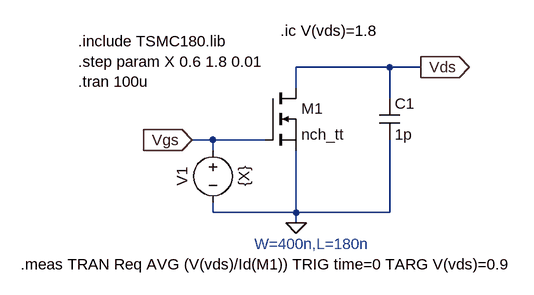
[diagram p0: schematic Prob_1a2.asc]
Prob_1a2.asc, the LTspice schematic file:
Version 4
SHEET 1 880 680
WIRE 288 48 144 48
WIRE 336 48 288 48
WIRE 144 80 144 48
WIRE 288 96 288 48
WIRE 16 160 -16 160
WIRE 96 160 16 160
WIRE 16 176 16 160
WIRE 16 272 16 256
WIRE 144 272 144 176
WIRE 144 272 16 272
WIRE 288 272 288 160
WIRE 288 272 144 272
WIRE 144 288 144 272
FLAG -16 160 Vgs
IOPIN -16 160 In
FLAG 144 288 0
FLAG 336 48 Vds
IOPIN 336 48 Out
SYMBOL nmos 96 80 R0
SYMATTR InstName M1
SYMATTR Value nch_tt
SYMATTR Value2 W=400n,L=180n
SYMBOL voltage 16 160 R0
WINDOW 0 -32 56 VBottom 2
WINDOW 3 32 56 VTop 2
WINDOW 123 0 0 Left 0
WINDOW 39 0 0 Left 0
SYMATTR InstName V1
SYMATTR Value {X}
SYMBOL cap 272 96 R0
SYMATTR InstName C1
SYMATTR Value 1p
SYMATTR SpiceLine IC=1.8
TEXT -192 8 Left 2 !.include TSMC180.lib\n.step param X 0.6 1.8 0.01\n.tran 100u
TEXT 120 -8 Left 2 !.ic V(vds)=1.8
TEXT -280 352 Left 2 !.meas TRAN Req AVG (V(vds)/Id(M1)) TRIG time=0 TARG V(vds)=0.9
TEXT 80 320 Left 2 ;W=400n,L=180n

The netlist it stands for:
* Prob_1a2.asc
M1 Vds Vgs 0 0 nch_tt W=400n,L=180n
V1 Vgs 0 {X}
C1 Vds 0 1p IC=1.8
.model NMOS NMOS
.model PMOS PMOS
.lib standard.mos
.include TSMC180.lib
.step param X 0.6 1.8 0.01
.tran 100u
.ic V(vds)=1.8
.meas TRAN Req AVG (V(vds)/Id(M1)) TRIG time=0 TARG V(vds)=0.9
* W=400n,L=180n
.backanno
.end

* Results of the author's LTspice run, read from the files saved beside the schematic
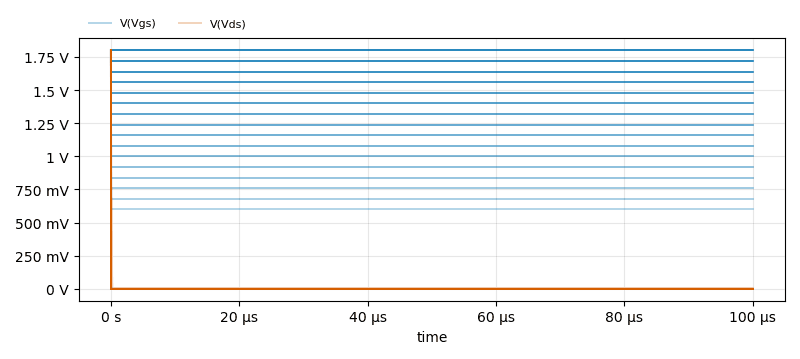
[diagram p1: Transient Analysis of Prob_1a2.asc, plotted from the saved traces]
* Transient Analysis, 121 runs:
*   V(Vgs) [run 1]: min 600 mV, max 600 mV, average 600 mV, rms 600 mV, last 600 mV
*   V(Vgs) [run 2]: min 680 mV, max 680 mV, average 680 mV, rms 680 mV, last 680 mV
*   V(Vgs) [run 3]: min 760 mV, max 760 mV, average 760 mV, rms 760 mV, last 760 mV
*   V(Vgs) [run 4]: min 840 mV, max 840 mV, average 840 mV, rms 840 mV, last 840 mV
*   V(Vgs) [run 5]: min 920 mV, max 920 mV, average 920 mV, rms 920 mV, last 920 mV
*   V(Vgs) [run 6]: min 1 V, max 1 V, average 1 V, rms 1 V, last 1 V
*   V(Vgs) [run 7]: min 1.08 V, max 1.08 V, average 1.08 V, rms 1.08 V, last 1.08 V
*   V(Vgs) [run 8]: min 1.16 V, max 1.16 V, average 1.16 V, rms 1.16 V, last 1.16 V
*   V(Vds) [run 1]: min 0 V, max 1.8 V, average 1.867 mV, rms 46.5 mV, last 0 V
*   V(Vds) [run 2]: min 0 V, max 1.8 V, average 839.4 µV, rms 31.39 mV, last 0 V
*   V(Vds) [run 3]: min 0 V, max 1.8 V, average 500.3 µV, rms 24.24 mV, last 0 V
*   V(Vds) [run 4]: min 0 V, max 1.8 V, average 352.4 µV, rms 20.5 mV, last 0 V
*   V(Vds) [run 5]: min 0 V, max 1.8 V, average 260.2 µV, rms 17.49 mV, last 0 V
*   V(Vds) [run 6]: min 0 V, max 1.8 V, average 208 µV, rms 15.69 mV, last 0 V
*   V(Vds) [run 7]: min 0 V, max 1.8 V, average 172.9 µV, rms 14.31 mV, last 0 V
*   V(Vds) [run 8]: min 0 V, max 1.8 V, average 144.9 µV, rms 13.01 mV, last 0 V
* From the log:
*   Measurement: req
*     step  AVG(v(vds)/id(m1))  FROM  TO
*        1  134195  0  9.67646e-008
*        2  119898  0  8.56235e-008
*        3  107850  0  7.68494e-008
*        4  97620  0  6.93168e-008
*        5  88948.3  0  6.28894e-008
*        6  81220.5  0  5.72142e-008
*        7  74552.8  0  5.22654e-008
*        8  68739.1  0  4.82112e-008
*        9  63642.6  0  4.46794e-008
*       10  59156.8  0  4.15778e-008
*       11  55186.8  0  3.88297e-008
*       12  51662.8  0  3.62879e-008
*       13  48542.1  0  3.40281e-008
*       14  45744.5  0  3.17699e-008
*       15  43135.4  0  2.97743e-008
*       16  40796.6  0  2.81399e-008
*       17  38672  0  2.66861e-008
*       18  36735.4  0  2.53701e-008
*       19  34965.3  0  2.41696e-008
*       20  33343.3  0  2.30702e-008
*       21  31853.1  0  2.20615e-008
*       22  30478.6  0  2.11396e-008
*       23  29206.7  0  2.02864e-008
*       24  28025.8  0  1.94948e-008
*       25  26931.5  0  1.87414e-008
*       26  25920.8  0  1.80382e-008
*       27  24985.5  0  1.74006e-008
*       28  24072  0  1.64909e-008
*       29  23240.8  0  1.58445e-008
*       30  22449.3  0  1.52981e-008
*       31  21705.6  0  1.47939e-008
*       32  21005.7  0  1.4322e-008
*       33  20345.8  0  1.38786e-008
*       34  19722.9  0  1.34609e-008
*       35  19134.1  0  1.30666e-008
*       36  18577.1  0  1.26939e-008
*       37  18049.2  0  1.23423e-008
*       38  17548.4  0  1.20089e-008
*       39  17073.5  0  1.16932e-008
*       40  16621.9  0  1.1394e-008
*     ...